# EAGLE design standalone_mod (EAGLE 7.7.0)
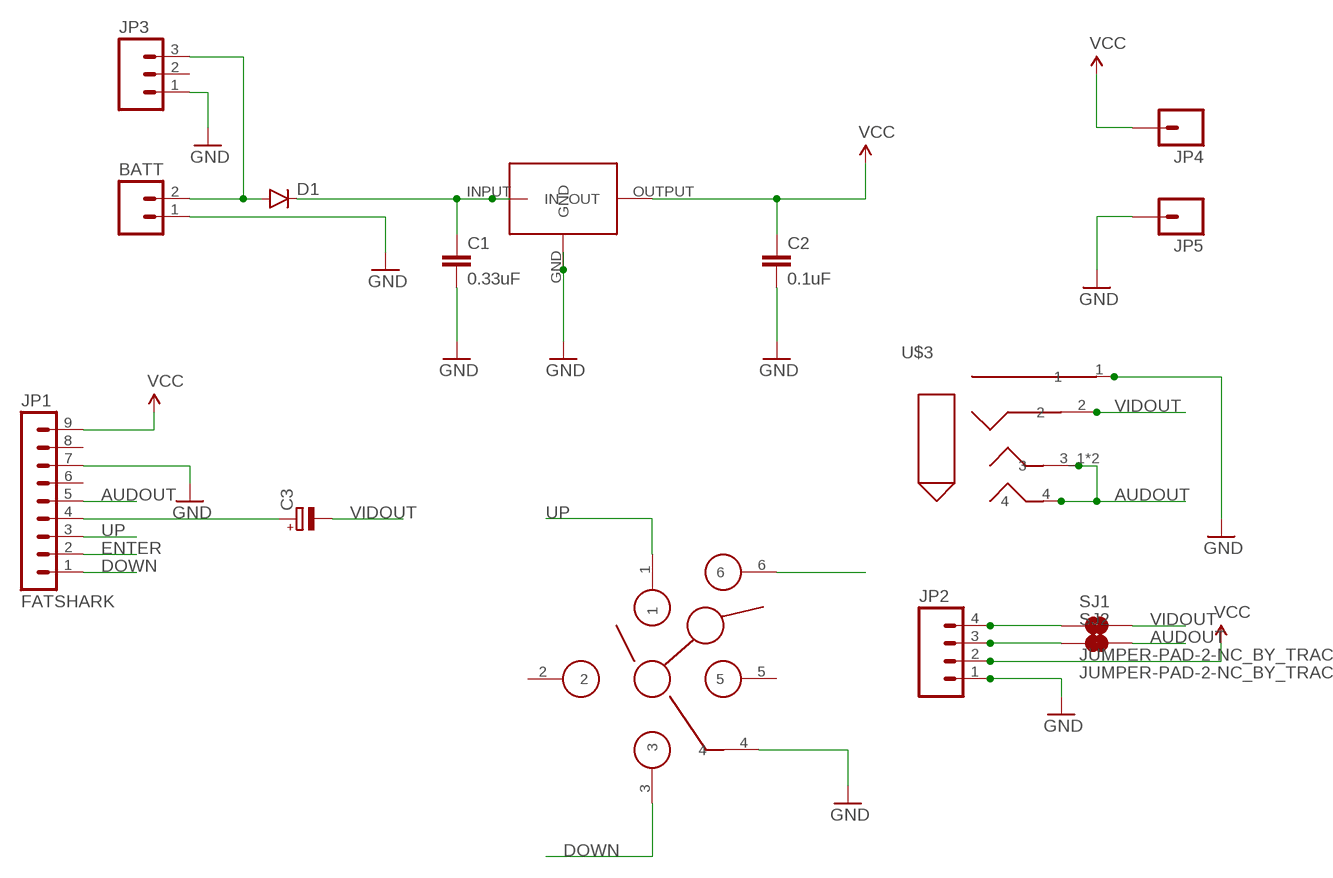
[diagram p0: schematic, sheet 1]

## Parts
BATT  M02LOCK_LONGPADS  [1X02_LOCK_LONGPADS]
C1  0.33uF  CAP0805  [0805]
C2  0.1uF  CAP0805  [0805]
C3  CPOL-EUE3.5-8  [E3,5-8]
D1  DIODESMA  [SMA-DIODE]
JP1  FATSHARK  MA09-1  [MA09-1]
JP2  M04PTH  [1X04]
JP3  M03LONGPADS  [1X03_LONGPADS]
JP4  M01SMD  [LUXEON-PAD]
JP5  M01SMD  [LUXEON-PAD]
SJ1  JUMPER-PAD-2-NC_BY_TRACE  [PAD-JUMPER-2-NC_BY_TRACE_YES_SILK]
SJ2  JUMPER-PAD-2-NC_BY_TRACE  [PAD-JUMPER-2-NC_BY_TRACE_YES_SILK]
U$1  7805  [DDPAK]
U$2  SKQUCAA010  [SKQUCAA010]
U$3  MC001293JACK  [MC001293]

## Nets
5V: C2.1 JP1.9 JP2.2 JP4.P$1 U$1.OUTPUT(OUT) ; supply symbol labelled VCC
AUDOUT: JP1.5 SJ2.2 U$3.3_1 U$3.3_2 U$3.4
DOWN: JP1.1 U$2.3
ENTER: JP1.2 U$2.6
GND: BATT.1 C1.2 C2.2 JP1.7 JP2.1 JP3.1 JP5.P$1 U$1.GND U$2.4 U$3.1
N$1: C1.1 D1.C U$1.INPUT(IN)
N$2: C3.+ JP1.4
N$3: BATT.2 D1.A JP3.3
N$4: JP2.4 SJ1.1
N$5: JP2.3 SJ2.1
UP: JP1.3 U$2.1
VIDOUT: C3.- SJ1.2 U$3.2
Unconnected: JP1.6 JP1.8 JP3.2 U$2.2 U$2.5

## Library data of the parts
BATT = SparkFun-Connectors:M02: Standard 2-pin 0.1" header. Use with - straight break away headers ( PRT-00116) - right angle break away headers (PRT-00553) - swiss pins (PRT-00743) - machine pins (PRT-00117) - female headers (PRT-00115) Molex polarized connector foot print use with: PRT-08233 with associated crimp pins and housings. 2.54_SCREWTERM for use with PRT-10571. 3.5mm Screw Terminal footprints for PRT-08084 5mm Screw Terminal footprints for use with PRT-08432
C1 C2 = SparkFun-Passives:CAP: Capacitor Standard 0603 ceramic capacitor, and 0.1" leaded capacitor.
C3 = resistor:CPOL-EU: POLARIZED CAPACITOR, European symbol
D1 = SparkFun-DiscreteSemi:DIODE: Diode These are standard reverse protection diodes and small signal diodes. SMA package can handle up to about 1A. SOD-323 can handle about 200mA. What the SOD-323 package when ordering, there are some mfgs out there that are 5-pin packages.
JP1 = con-lstb:MA09-1: PIN HEADER; OC_FARNELL: unknown; OC_NEWARK: unknown
JP2 = SparkFun-Connectors:M04: Header 4 Standard 4-pin 0.1" header. Use with straight break away headers (SKU : PRT-00116), right angle break away headers (PRT-00553), swiss pins (PRT-00743), machine pins (PRT-00117), and female headers (PRT-00115). Molex polarized connector foot print use with SKU : PRT-08231 with associated crimp pins and housings. 1MM SMD Version SKU: PRT-10208
JP3 = SparkFun-Connectors:M03: Header 3 Standard 3-pin 0.1" header. Use with straight break away headers (SKU : PRT-00116), right angle break away headers (PRT-00553), swiss pins (PRT-00743), machine pins (PRT-00117), and female headers (PRT-00115). Molex polarized connector foot print use with SKU : PRT-08232 with associated crimp pins and housings.
JP4 JP5 = SparkFun-Connectors:M01: Header 1 Standard 1-pin 0.1" header. Use with straight break away headers (SKU : PRT-00116), right angle break away headers (PRT-00553), swiss pins (PRT-00743), machine pins (PRT-00117), and female headers (PRT-00115). SMTSO-256-ET is a "flush mount" nut for a 4-40 screw. The older package used to be too tight, and did not allow it to sit properly thru the drill hit. The latest (0.165DIA) fits nice and snug.
SJ1 SJ2 = SparkFun-Passives:JUMPER-PAD-2-NC_BY_TRACE
U$1 = #fpv:7805
U$2 = #fpv:SKQUCAA010
U$3 = #fpv:MC001293JACK

## Net classes
0 default: width 0.254 mm, clearance 0.254 mm
1 vcc: width 0.254 mm
2 gnd: width 0.305 mm, drill 0.559 mm, clearance 0.254 mm
3 usbvcc: width 0.508 mm, drill 0.61 mm, clearance 0.254 mm

## Board
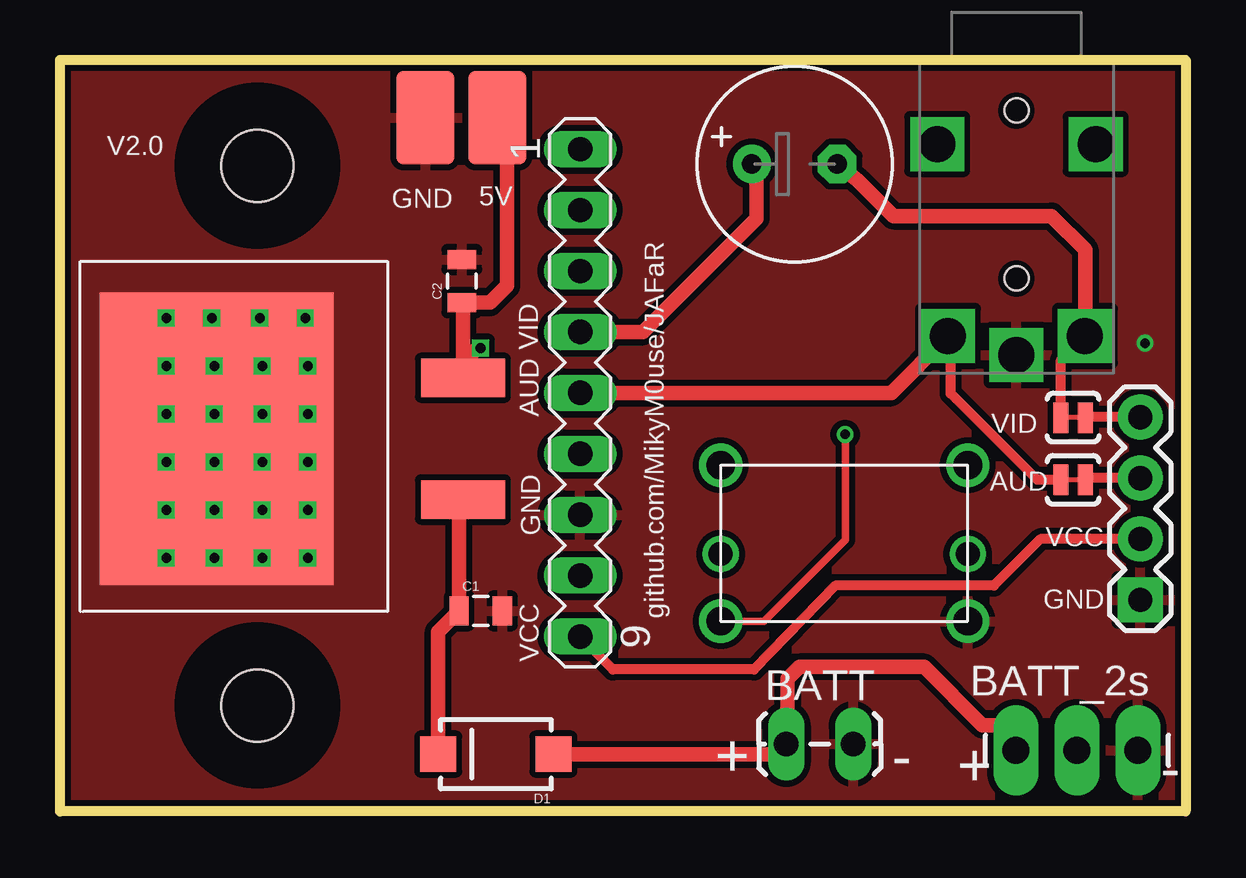
[diagram p1: board, top side]
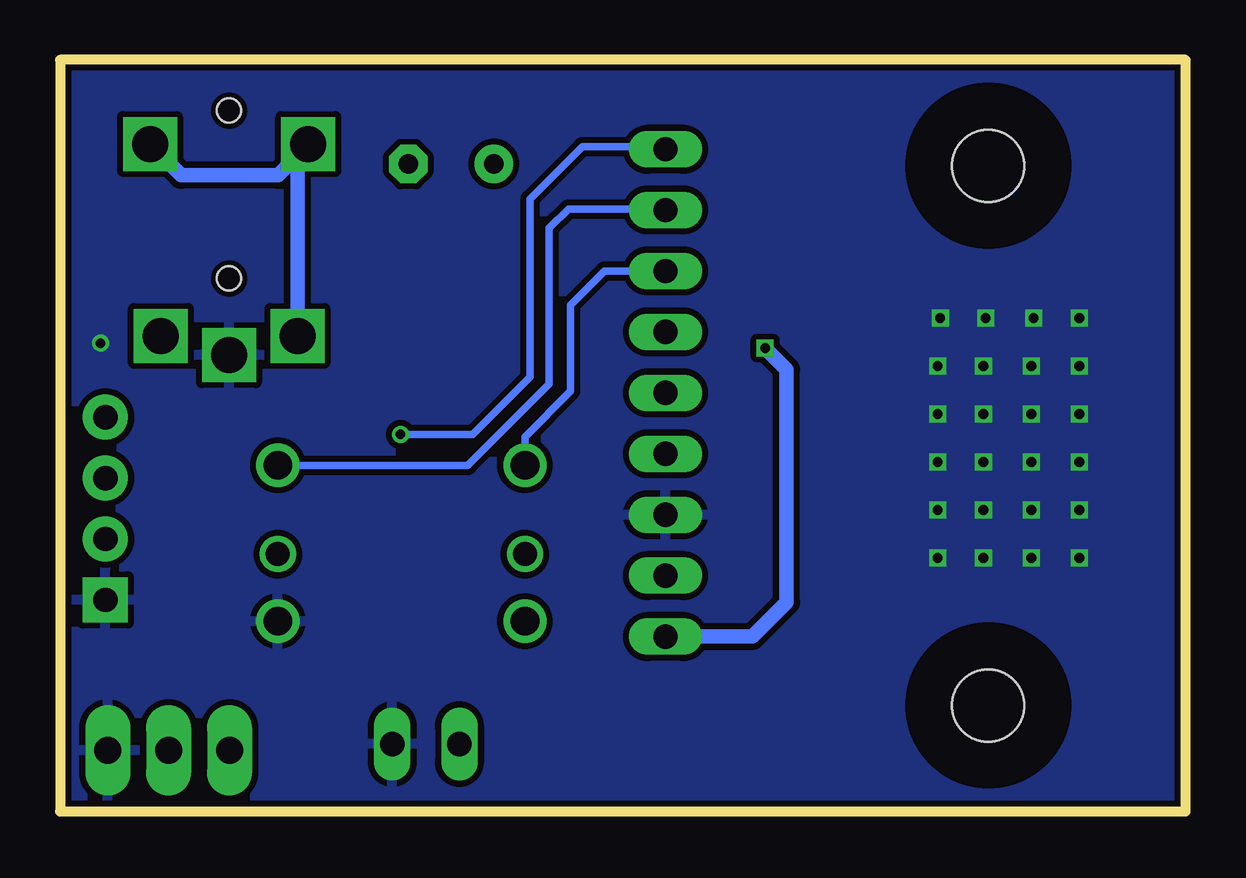
[diagram p2: board, bottom side, seen from below]

Size 46.92 x 31.33 mm. Coordinates in mm from the lower left corner, seen from the top.
Outline: 0,0 0,31.33 46.92,31.33 46.92,0 0,0
Copper layers (1*16): Top 0.035mm / dielectric 1.5mm / Bottom 0.035mm
Design rules "dirt_cheap_dirty_boards.v1": minimum track width 5mil, minimum drill 12mil, track to track 5mil, track to pad 5mil, pad to pad 5mil, via to via 5mil, smd to smd 0mil, copper to edge 10mil, drill to drill 10mil, minimum pad ring 10mil, minimum via ring 6mil, stop-mask expansion 2mil, vias tented up to drill 25mil, thermal gap 10mil
Holes 3 mm at 8.23,26.92 8.23,4.42
tRestrict: area 5.2,23.9 to 11.2,29.9; area 5.2,1.4 to 11.2,7.4
bRestrict: area 5.2,23.9 to 11.2,29.9; area 5.2,1.4 to 11.2,7.4

### Footprints (pad centres in the part's own frame; a part is rotated, then mirrored left to right if it is on the bottom)
1X02_LOCK_LONGPADS = drill 1.016 long: 1 -0.127,0; 2 2.667,0
0805 = smd 0.8 x 1.2: 1 -0.9,0; 2 0.9,0
E3,5-8 = drill 0.813 pad 1.6: + -1.778,0 | drill 0.813 pad 1.6 octagon: - 1.778,0
SMA-DIODE = smd 1.5 x 1.47: A -2.4,0; C 2.4,0
MA09-1 = drill 1.016 long: 1 -10.16,0; 2 -7.62,0; 3 -5.08,0; 4 -2.54,0; 5 0,0; 6 2.54,0; 7 5.08,0; 8 7.62,0; 9 10.16,0
1X04 = drill 1.016 pad 1.88 square: 1 0,0 | drill 1.016 pad 1.88: 2 2.54,0; 3 5.08,0; 4 7.62,0
1X03_LONGPADS = drill 1.118 pad 1.88 long: 1 0,0; 2 2.54,0; 3 5.08,0
LUXEON-PAD = smd 3.9 x 2.4: P$1 0,0
PAD-JUMPER-2-NC_BY_TRACE_YES_SILK = smd 0.635 x 1.27: 1 -0.508,0; 2 0.508,0
DDPAK = smd 12.2 x 9.75: GND 6.1,12.025 | smd 1.6 x 3.5: INPUT 3.56,1.75; OUTPUT 8.64,1.75
SKQUCAA010 = drill 1.2: 1 0,6.5; 3 0,0; 4 10.3,0; 6 10.3,6.5 | drill 1: 2 0,2.8; 5 10.3,2.8
MC001293 = drill 1.5 square: 1 2.85,-0.8; 2 5.7,0; 3_1 6.15,8; 3_2 -0.45,8; 4 0,0 | hole 1: 2.85,2.4; 2.85,9.4

### Placement (x,y rotation side)
BATT  32.94,2.81 180 top
C1  17.54,8.36 0 top
C2  16.75,22.11 90 top
C3  30.62,26.99 0 top
D1  18.17,2.39 180 top
JP1  21.68,17.45 270 top
JP2  45.03,8.82 90 top
JP3  44.93,2.55 180 top
JP4  18.23,28.92 90 top
JP5  15.23,28.92 90 top
SJ1  42.23,16.42 180 top
SJ2  42.23,13.82 180 top
U$1  18.55,9.44 90 top
U$2  27.54,7.93 0 top
U$3  37.02,19.82 0 top

### Tracks (layer width: path | path; a pad name or v marks a point on that pad's centre or on a via)
5V  (via drill 0.4)
  Top 0.406: JP1.9 23.05,5.92 28.93,5.92 32.33,9.42 38.93,9.42 40.87,11.36 JP2.2
  Top 0.61: U$1.OUTPUT 16.8,18.72 | 16.8,18.72 16.8,21.16 C2.1 17.92,21.21 18.63,21.92 18.63,28.02 JP4.P$1 | v17.53,19.32 17.4,19.32 16.8,18.72
  Bottom 0.61: JP1.9 18.06,7.29 16.63,8.72 16.63,18.42 v17.53,19.32
AUDOUT
  Top 0.406: SJ2.2 40.73,13.82 37.13,17.42 37.13,19.71 U$3.4
  Top 0.61: JP1.5 34.65,17.45 U$3.4
  Bottom 0.61: U$3.3_1 41.87,26.52 37.83,26.52 36.57,27.78 U$3.3_2 37.02,27.37 U$3.4
DOWN  (via drill 0.4)
  Top 0.305: U$2.3 29.34,7.93 32.73,11.32 v32.73,15.72
  Bottom 0.305: v32.73,15.72 29.73,15.72 27.33,18.12 27.33,25.52 25.13,27.72 21.79,27.72 JP1.1
  Bottom 0.61: JP1.1
ENTER
  Bottom 0.305: U$2.6 29.92,14.43 26.53,17.82 26.53,24.32 25.73,25.12 21.73,25.12 JP1.2
GND  (via drill 0.4)
  other vias: 4.43,20.57 4.43,18.57 4.43,16.57 4.43,14.57 4.43,12.57 4.43,10.57 6.33,20.57 6.43,18.57 6.43,16.57 6.43,14.57 6.43,12.57 6.43,10.57 8.33,20.57 8.43,18.57 8.43,16.57 8.43,14.57 8.43,12.57 8.43,10.57 10.23,20.57 10.33,18.57 10.33,16.57 10.33,14.57 10.33,12.57 10.33,10.57 45.23,19.52
  pour Bottom (isolate 0.254): -0.65,0.51 46.75,0.38 46.75,30.74 -0.54,30.86
  pour Top (isolate 0.254): -1.03,0.38 46.88,0.38 46.88,30.74 -0.66,30.86
N$1
  Top 0.61: D1.C 15.77,7.49 C1.1 16.64,12.84 U$1.INPUT
N$2
  Top 0.61: JP1.4 24.3,19.99 29.03,24.72 29.03,26.28 C3.+
N$3
  Top 0.61: D1.A 30.05,2.39 BATT.2 30.33,2.75 | 30.33,2.75 30.33,5.52 30.83,6.02 36.03,6.02 38.45,3.6 39.1,3.6 JP3.3 | 30.33,2.12 30.33,2.75
N$4
  Top 0.406: JP2.4 42.76,16.44 SJ1.1
N$5
  Top 0.406: JP2.3 42.74,13.9 SJ2.1
UP
  Bottom 0.305: U$2.1 27.54,15.61 25.63,17.52 25.63,21.12 24.23,22.52 JP1.3
VIDOUT
  Top 0.406: SJ1.2 41.72,18.82 U$3.2
  Top 0.61: C3.- 33.26,26.29 34.73,24.82 41.33,24.82 42.73,23.42 U$3.2

### Text on the board
tNames: V2.0 | GND | 5V | github.com/MikyM0use/JAFaR | VID | AUD | VID | AUD | GND | VCC | GND | VCC | BATT_2s | + | - | + | -